# Altium schematic sheet BLE.SchDoc: Gravix Sensor V1
size A4; CheckedBy: Kanishka Nimesh; DrawnBy: Thilina Nuwarapaksha; Revision: A; SheetNumber: 4; SheetTotal: 8
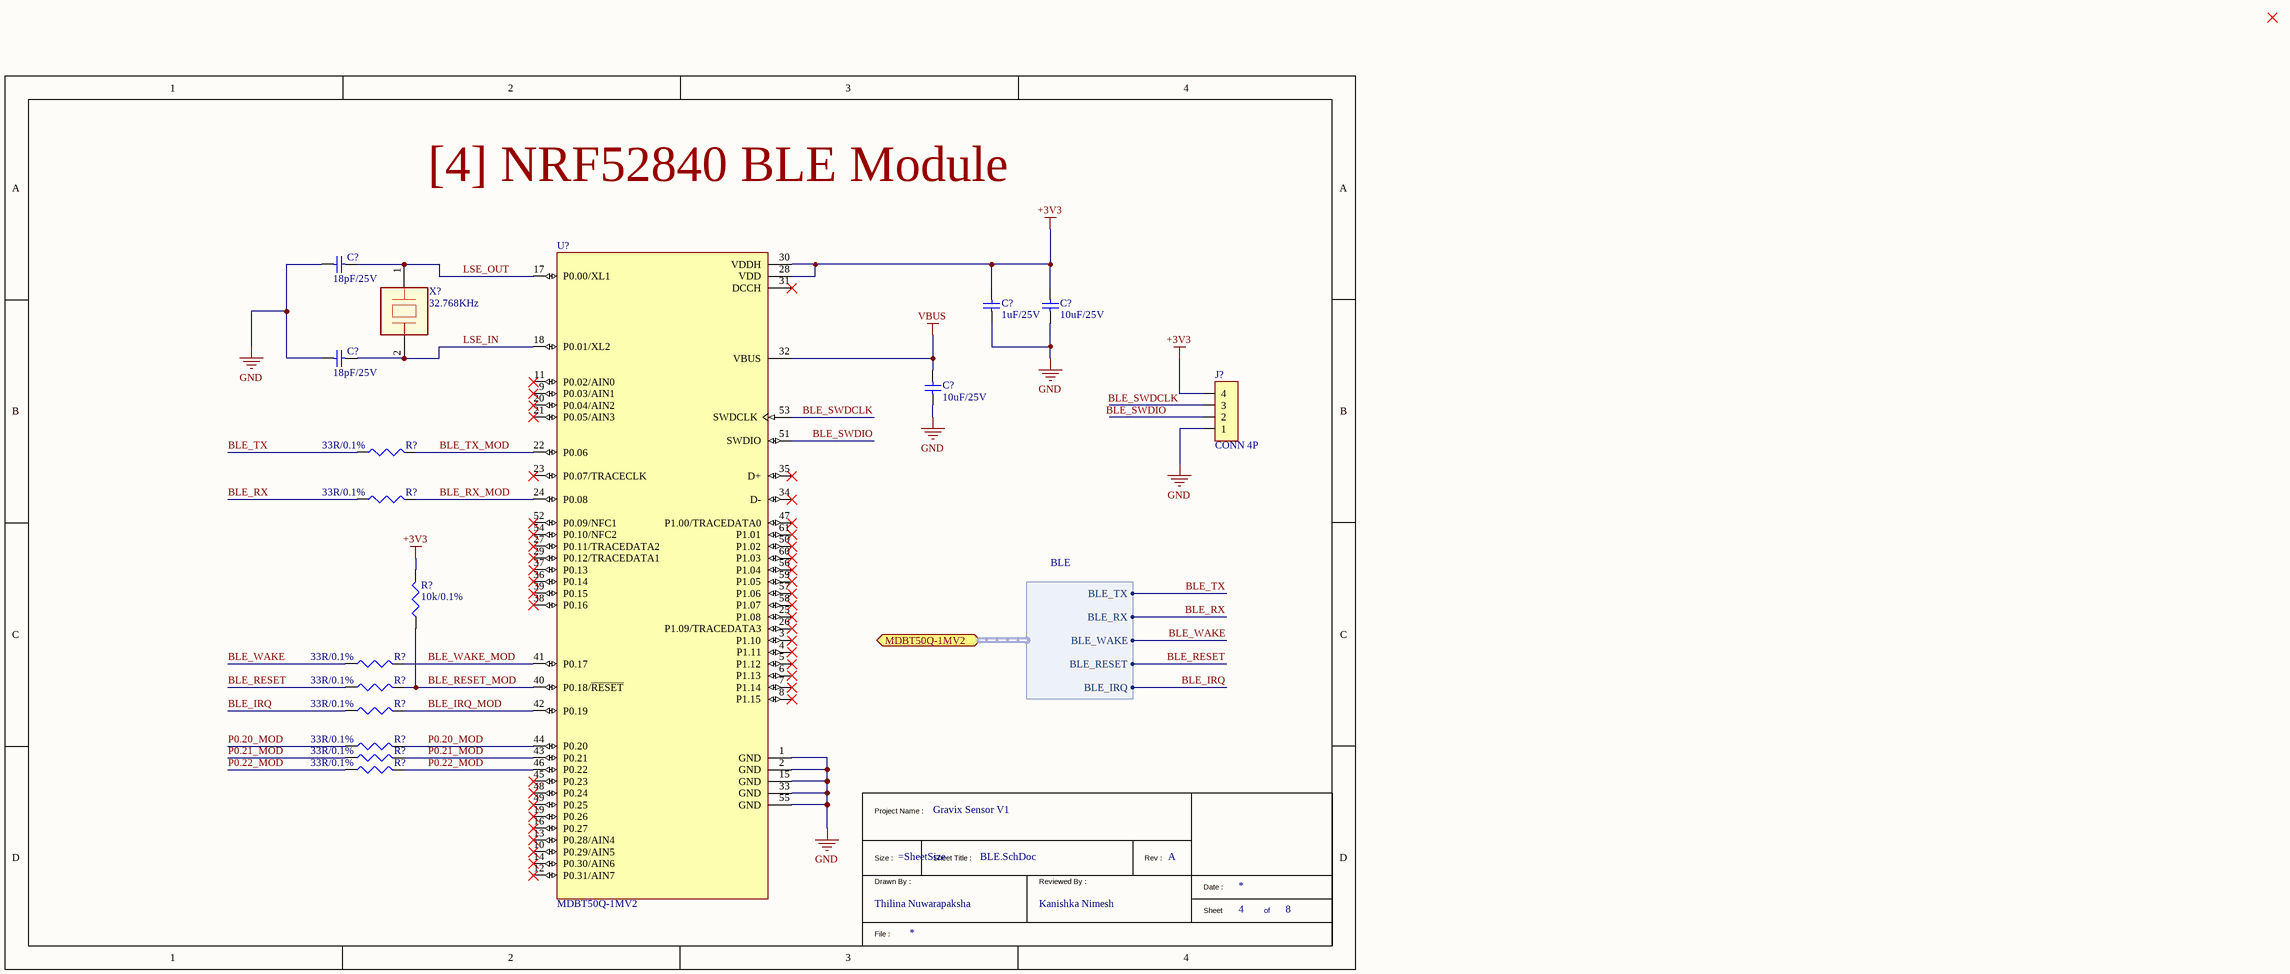
[diagram p0: BLE.SchDoc]

## Parts
(Parts that share a designator on the sheet are numbered #1, #2 ... from top to bottom, then left to right.)
*  TitleBlock1  (value not drawn)  (graphical)
C?#1  18pF/25V  [CAP_0402]
C?#2  1uF/25V  [CAP_0805]
C?#3  10uF/25V  [CAP_1206]
C?#4  18pF/25V  [CAP_0402]
C?#5  10uF/25V  [CAP_1206]
J?  CONN 4P  [JST_SH_1.00]
R?#1  33R/0.1%  [RES_0402]
R?#2  33R/0.1%  [RES_0402]
R?#3  10k/0.1%  [RES_0402]
R?#4  33R/0.1%  [RES_0402]
R?#5  33R/0.1%  [RES_0402]
R?#6  33R/0.1%  [RES_0402]
R?#7  33R/0.1%  [RES_0402]
R?#8  33R/0.1%  [RES_0402]
R?#9  33R/0.1%  [RES_0402]
U?  MDBT50Q-1MV2  [MDBT50Q-1MV2_SMD-61]
X?  32.768KHz  [32.768KHz_SMD2012-2P]

## Ports
MDBT50Q-1MV2 (bidir, harness BLE)

## Harnesses
BLE: BLE_TX, BLE_RX, BLE_WAKE, BLE_RESET, BLE_IRQ

## Nets
+3V3: C?#2.2 C?#3.2 J?.4 R?#3.2 U?.28(VDD) U?.30(VDDH)
GND: C?#1.2 C?#2.1 C?#3.1 C?#4.2 C?#5.1 J?.1 U?.1(GND) U?.2(GND) U?.15(GND) U?.33(GND) U?.55(GND)
VBUS: C?#5.2 U?.32(VBUS)
BLE_IRQ: R?#6.1 ; port MDBT50Q-1MV2.BLE_IRQ
BLE_IRQ_MOD: R?#6.2 U?.42(P0.19)
BLE_RESET: R?#5.1 ; port MDBT50Q-1MV2.BLE_RESET
BLE_RESET_MOD: R?#3.1 R?#5.2 U?.40(P0.18/~{RESET})
BLE_RX: R?#2.1 ; port MDBT50Q-1MV2.BLE_RX
BLE_RX_MOD: R?#2.2 U?.24(P0.08)
BLE_SWDCLK: J?.3 U?.53(SWDCLK)
BLE_SWDIO: J?.2 U?.51(SWDIO)
BLE_TX: R?#1.1 ; port MDBT50Q-1MV2.BLE_TX
BLE_TX_MOD: R?#1.2 U?.22(P0.06)
BLE_WAKE: R?#4.1 ; port MDBT50Q-1MV2.BLE_WAKE
BLE_WAKE_MOD: R?#4.2 U?.41(P0.17)
LSE_IN: C?#4.1 U?.18(P0.01/XL2) X?.2(GND)
LSE_OUT: C?#1.1 U?.17(P0.00/XL1) X?.1
P0.20_MOD: R?#7.1 R?#7.2 U?.44(P0.20)
P0.21_MOD: R?#8.1 R?#8.2 U?.43(P0.21)
P0.22_MOD: R?#9.1 R?#9.2 U?.46(P0.22)

Not connected (* = marked no-connect by the designer): U? 3(P1.10)* 4(P1.11)* 5(P1.12)* 6(P1.13)* 7(P1.14)* 8(P1.15)* 9(P0.03/AIN1)* 10(P0.29/AIN5)* 11(P0.02/AIN0)* 12(P0.31/AIN7)* 13(P0.28/AIN4)* 14(P0.30/AIN6)* 16(P0.27)* 19(P0.26)* 20(P0.04/AIN2)* 21(P0.05/AIN3)* 23(P0.07/TRACECLK)* 25(P1.08)* 26(P1.09/TRACEDATA3)* 27(P0.11/TRACEDATA2)* 29(P0.12/TRACEDATA1)* 31(DCCH)* 34(D-)* 35(D+)* 36(P0.14)* 37(P0.13)* 38(P0.16)* 39(P0.15)* 45(P0.23)* 47(P1.00/TRACEDATA0)* 48(P0.24)* 49(P0.25)* 50(P1.02)* 52(P0.09/NFC1)* 54(P0.10/NFC2)* 56(P1.04)* 57(P1.06)* 58(P1.07)* 59(P1.05)* 60(P1.03)* 61(P1.01)*

## Notes on the sheet
- [4] NRF52840 BLE Module
- (in symbol TitleBlock1) Project Name :; Size :; Sheet Title :; Rev :; Drawn By :; Reviewed By :; Date :; Sheet; of; File :

## Library data of the parts
C?#1 C?#4 = YAGEO CC0402GRNPO8BN180: 18pF ±2% 25V Ceramic Capacitor NP0 0402; Manufacturer: YAGEO; Manufacturer Part Number: CC0402GRNPO8BN180; LCSC Part Number: C526984; Package: 0402; Mounting Type: SMD; ComponentLink2Description: Digikey Link; ComponentLink3Description: LCSC Link; ComponentLink3URL: https://www.lcsc.com/product-detail/C526984.html?spm=wm.fly.bg.0.xh___wm.fly.dhl.mly.12-0-4&lcsc_vid=QlAIX1RQQQJfX1VRTwcNAQJXTlRaUQBVEQBYAwJfFFcxVlNRQFhYU1xWRFVdXztW
C?#2 = YAGEO CC0805KKX7R8BB105: 1uF ±10% 25V Ceramic Capacitor X7R 0805; Manufacturer: YAGEO; Manufacturer Part Number: CC0805KKX7R8BB105; LCSC Part Number: C91186; Package: 0805; Mounting Type: SMD; ComponentLink2Description: Digikey Link; ComponentLink3Description: LCSC Link; ComponentLink3URL: https://www.lcsc.com/product-detail/C91186.html?spm=wm.fly.bg.0.xh___wm.fly.dhl.mly.12-0-4&lcsc_vid=QlAIX1RQQQJfX1VRTwcNAQJXTlRaUQBVEQBYAwJfFFcxVlNRT1FbV1FfR1JZUDsOAxUeFF5JWBYZEEoKFBINSQcJGk4dAgUUFAk%3D
C?#3 C?#5 = muRata GRM31CR71E106KA12L: 10uF ±10% 25V Ceramic Capacitor X7R 1206; Manufacturer: muRata; Manufacturer Part Number: GRM31CR71E106KA12L; LCSC Part Number: C77093; Package: 1206; Mounting Type: SMD; ComponentLink2Description: Digikey Link; ComponentLink3Description: LCSC Link; ComponentLink3URL: https://www.lcsc.com/product-detail/C77093.html?spm=wm.fly.bg.1.xh___wm.sxq.dhl.mly.12-0-4&lcsc_vid=QlAIX1RQQQJfX1VRTwcNAQJXTlRaUQBVEQBYAwJfFFcxVlNRT1FaUl1VQVZcUDsOAxUeFF5JWBYZEEoKFBINSQcJGk4%3D
J? = JST_4P_SH: Connector Header 4 position 1mm Pitch 1A Surface Mount, Right Angle -25℃~+85℃; Manufacturer: JST; Manufacturer Part Number: SM04B-SRSS-TB(LF)(SN); LCSC Part Number: C160404; Package: SMD,P=1mm,Surface Mount,Right Angle; ComponentLink1Description: Digikey Link; Mounting Type: SMD; ComponentLink2Description: LCSC Link; ComponentLink2URL: https://www.lcsc.com/product-detail/C160404.html?spm=wm.fly.bg.0.xh&lcsc_vid=QlAIX1RQQQJfX1VRTwcNAQJXTlRaUQBVEQBYAwJfFFcxVlNRT1RYUldfQ1BaVTsOAxUeFF5JWBYZEEoKFBINSQcJGk4NBhADEA4cHktRTlNADxALGw%3D%3D
R?#1 R?#2 R?#4-R?#9 = YAGEO RT0402BRD0733RL: 33Ω 63mW 50V Thin Film Resistor ±25ppm/℃ ±0.1% 0402 Chip Resistor - Surface Mount RoHS; Manufacturer: YAGEO; Manufacturer Part Number: RT0402BRD0733RL; LCSC Part Number: C852729; Package: 0402; ComponentLink1Description: Digikey Link; Mounting Type: SMD; ComponentLink2Description: LCSC Link; ComponentLink2URL: https://www.lcsc.com/product-detail/C852729.html?spm=wm.fly.bg.0.xh___wm.fly.dhl.mly.12-6-1&lcsc_vid=QlAIX1RQQQJfX1VRTwcNAQJXTlRaUQBVEQBYAwJfFFcxVlNRT1BXUFVTRlNXVDtW
R?#3 = YAGEO RT0402BRD0710KL: 62.5mW 10kΩ 50V Thin Film Resistor ±25ppm/℃ ±0.1% 0402 Chip Resistor - Surface Mount RoHS; Manufacturer: YAGEO; Manufacturer Part Number: RT0402BRD0710KL; LCSC Part Number: C190095; Package: 0402; ComponentLink1Description: Digikey Link; Mounting Type: SMD; ComponentLink2Description: LCSC Link; ComponentLink2URL: https://www.lcsc.com/product-detail/C190095.html?spm=wm.fly.bg.0.xh___wm.fly.dhl.mly.12-6-1&lcsc_vid=QlAIX1RQQQJfX1VRTwcNAQJXTlRaUQBVEQBYAwJfFFcxVlNRT1FbV1FfR1JZUDsOAxUeFF5JWBYZEEoKFBINSQcJGk4dAgUUFAk%3D
U? = RAYTAC MDBT50Q-1MV2: SMD-61P RF Transceiver Modules and Modems RoHS; Manufacturer: RAYTAC; Manufacturer Part Number: MDBT50Q-1MV2; LCSC Part Number: C5118826; Package: SMD-61P; Mounting Type: SMD; ComponentLink2Description: Digikey Link; ComponentLink3Description: LCSC Link; ComponentLink3URL: https://www.lcsc.com/product-detail/C5118826.html?s_z=n_q_MDBT50Q-1MV2&spm=wm.ssy.bg.0.xh&lcsc_vid=QlAIX1RQQQJfX1VRTwcNAQJXTlRaUQBVEQBYAwJfFFcxVlNRQFhZUlxfQlRcXzsOAxUeFF5JWBYZEEoKFBINSQcJGk4eFQsCAgIaSgADAwAHC0slRlRZU1ZIHxUDCw%3D%3D
X? = 32.768KHz 2P: Crystal 32.768kHz ±20ppm 12.5pF SMD2012-2P; Manufacturer: KYX; Manufacturer Part Number: K2A32768125202; LCSC Part Number: C19076730; Package: SMD2012-2P; ComponentLink1Description: Digikey Link; ComponentLink2Description: LCSC Link; ComponentLink2URL: https://www.lcsc.com/product-detail/C19076730.html?spm=wm.fly.bg.2.xh___wm.sxq.dhl.mly.12-1-1&lcsc_vid=QlAIX1RQQQJfX1VRTwcNAQJXTlRaUQBVEQBYAwJfFFcxVlNRQFhYU1xWRFVdXztW; Mounting Type: SMD